# EAGLE design PIPCB (EAGLE 8.6.3)
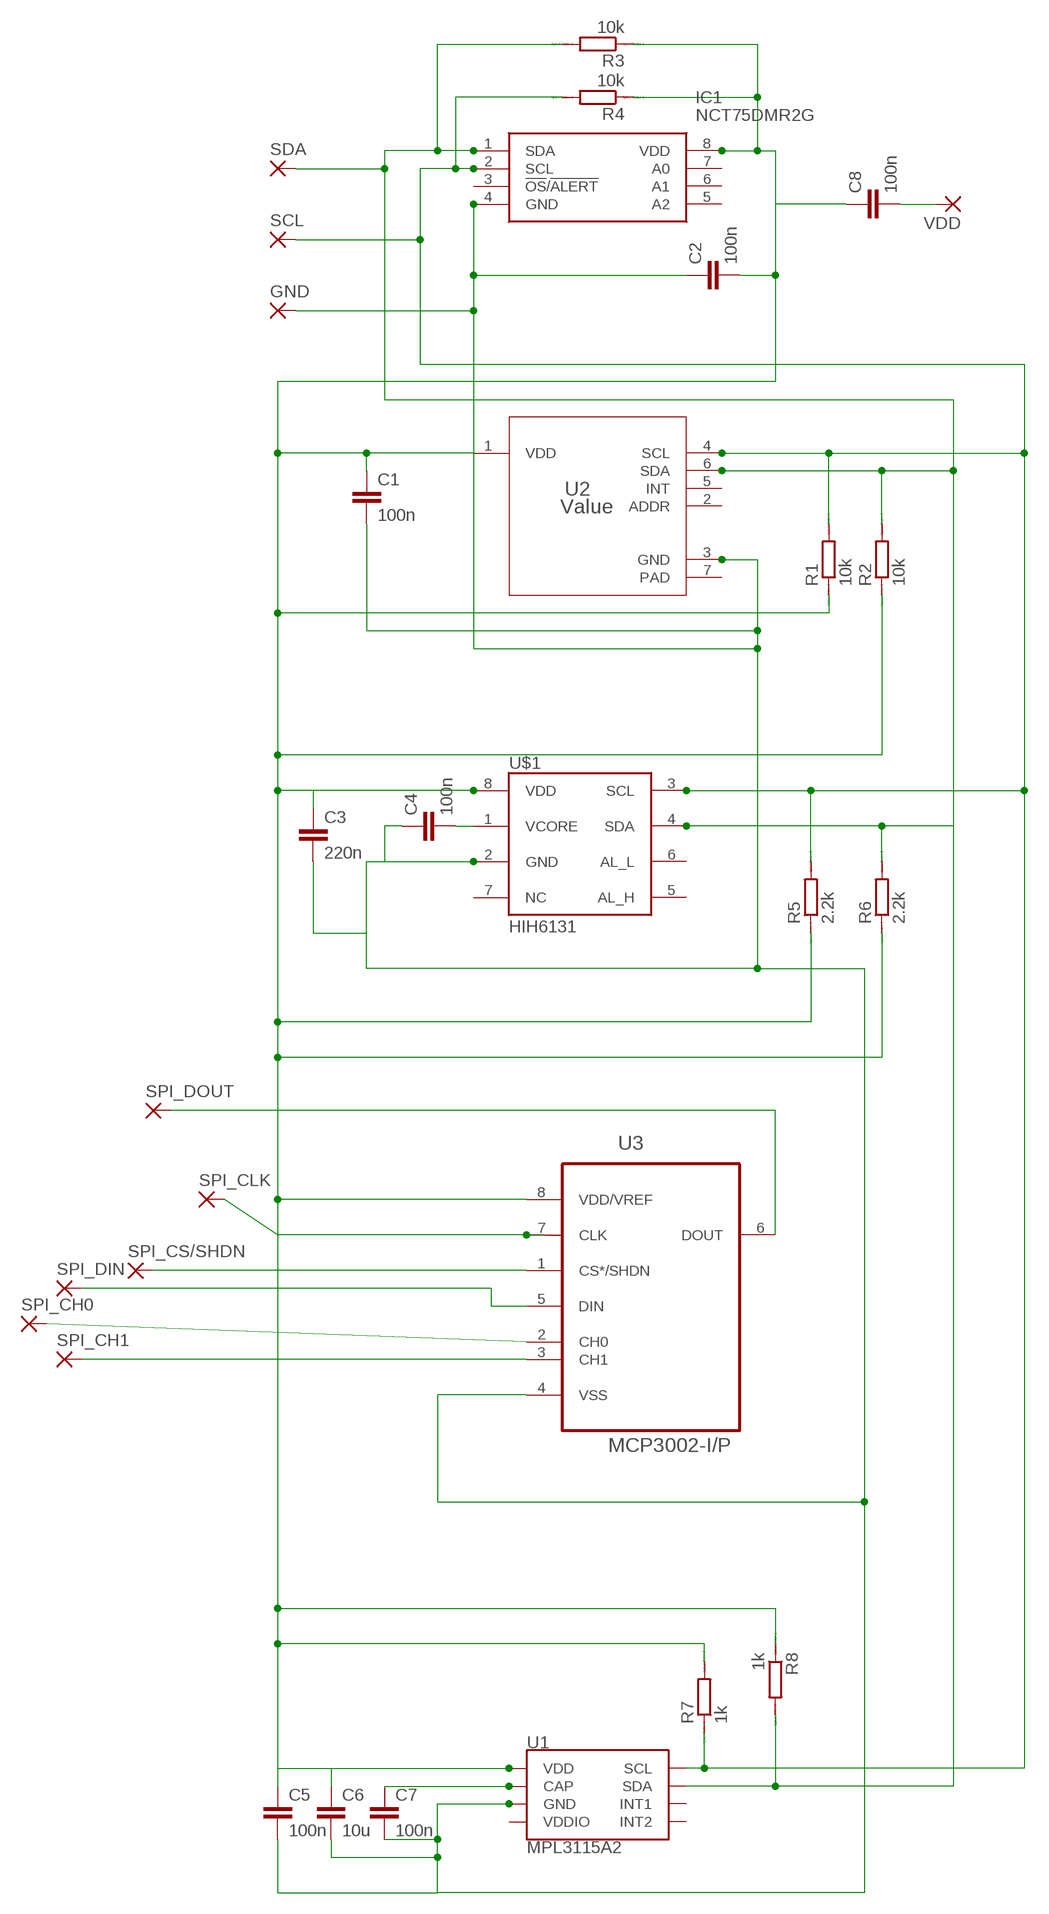
[diagram p0: schematic, sheet 1]

## Parts
C1  100n  C2,5-3  [C2.5-3]
C2  100n  C2,5-3  [C2.5-3]
C3  220n  C2,5-3  [C2.5-3]
C4  100n  C2,5-3  [C2.5-3]
C5  100n  C2,5-3  [C2.5-3]
C6  10u  C2,5-3  [C2.5-3]
C7  100n  C2,5-3  [C2.5-3]
C8  100n  C2,5-3  [C2.5-3]
GND  2,54/0,8  [2,54/0,8]
IC1  NCT75DMR2G  [SOP65P490X110-8N]
R1  10k  R0207/10  [0207/10]
R2  10k  R0207/10  [0207/10]
R3  10k  R0207/10  [0207/10]
R4  10k  R0207/10  [0207/10]
R5  2.2k  R0207/10  [0207/10]
R6  2.2k  R0207/10  [0207/10]
R7  1k  R0207/10  [0207/10]
R8  1k  R0207/10  [0207/10]
SCL  2,54/0,8  [2,54/0,8]
SDA  2,54/0,8  [2,54/0,8]
SPI_CH0  2,54/0,8  [2,54/0,8]
SPI_CH1  2,54/0,8  [2,54/0,8]
SPI_CLK  2,54/0,8  [2,54/0,8]
SPI_CS/SHDN  2,54/0,8  [2,54/0,8]
SPI_DIN  2,54/0,8  [2,54/0,8]
SPI_DOUT  2,54/0,8  [2,54/0,8]
U1  MPL3115A2  [LGA-8-5X3]
U2  Value  OPT3001DNPR  [DNP0006A]
U3  MCP3002-I/P  [DIP254P762X533-8]
U$1  HIH6131  [SOIC8]
VDD  2,54/0,8  [2,54/0,8]

## Nets
GND: C1.2 C2.1 C3.2 C4.1 C5.2 C6.2 C7.2 GND.1(P) IC1.4(GND) U1.3(GND) U2.3(GND) U3.4(VSS) U$1.2(GND)
N$1: C1.1 C2.2 C3.1 C5.1 C6.1 C8.1 IC1.8(VDD) R1.1 R2.1 R3.1 R4.1 R5.1 R6.1 R7.2 R8.1 U1.1(VDD) U2.1(VDD) U3.8(VDD/VREF) U$1.8(VDD)
N$2: C8.2 VDD.1(P)
N$3: IC1.2(SCL) R1.2 R4.2 R5.2 R7.1 SCL.1(P) U1.8(SCL) U2.4(SCL) U$1.3(SCL)
N$4: IC1.1(SDA) R2.2 R3.2 R6.2 R8.2 SDA.1(P) U1.7(SDA) U2.6(SDA) U$1.4(SDA)
N$6: C4.2 U$1.1(VCORE)
N$7: SPI_DOUT.1(P) U3.6(DOUT)
N$8: SPI_CLK.1(P) U3.7(CLK)
N$9: SPI_CS/SHDN.1(P) U3.1(CS*/SHDN)
N$10: C7.1 U1.2(CAP)
N$11: SPI_DIN.1(P) U3.5(DIN)
N$12: SPI_CH0.1(P) U3.2(CH0)
N$13: SPI_CH1.1(P) U3.3(CH1)
Unconnected: IC1.3(!OS!/!ALERT) IC1.5(A2) IC1.6(A1) IC1.7(A0) U1.5(INT2) U1.6(INT1) U2.2(ADDR) U2.5(INT) U2.7(PAD) U$1.5(AL_H) U$1.6(AL_L) U$1.7(NC)

## Power pins joined to a net without a drawn wire
VDDIO: U1.4(VDDIO)

## Library data of the parts
C1-C8 = capacitor-wima:C: CAPACITOR naming: grid - package width
GND SCL SDA SPI_CH0 SPI_CH1 SPI_CLK SPI_CS/SHDN SPI_DIN SPI_DOUT VDD = wirepad:2,54/0,8: THROUGH-HOLE PAD
IC1 = NCT75DMR2G:NCT75DMR2G: Source: Datasheet <http://www.onsemi.com/pub/Collateral/NCT75-D.PDF>; ALLIED_NUMBER: 70467170; ALLIED_PRICE/STOCK: http://www.alliedelec.com/on-semiconductor-nct75dmr2g/70467170/; HEIGHT: 1.1mm; MANUFACTURER_NAME: ON Semiconductor; MANUFACTURER_PART_NUMBER: NCT75DMR2G; RS_PART_NUMBER: 8064942; RS_PRICE/STOCK: http://uk.rs-online.com/web/p/products/8064942
R1-R8 = eagle-ltspice:R: RESISTOR, European symbol; SPICEMODEL: NONE; SPICEPREFIX: R
U1 = SparkFun-Sensors:MPL3115A2: NXP MPL3115A2 Digital Altimeter/Pressure Sensor The MPL3115A2 is a compact piezoresistive absolute pressure sensor with an I2C interface. MPL3115 has a wide operating range of 20kPa to 110 kPa, a range that covers all surface elevations on Earth. The fully internally compensated MEMS in conjunction with an embedded high resolution 24-bit equivalent ADC provide accurate pressure [Pascals] /altitude [meters] and temperature [degrees Celsius] data. Datasheet <http://cdn.sparkfun.com/datasheets/Sensors/Pressure/MPL3115A2.pdf> SparkFun Products SparkFun Altitude/Pressure Sensor Breakout - MPL3115A2 <https://www.sparkfun.com/products/11084> (SEN-11084) SparkFun Weather Shield <https://www.sparkfun.com/products/12081> (DEV-12081) SparkFun Photon Weather Shield <https://www.sparkfun.com/products/13630> (DEV-13630); PROD_ID: IC-10869
U2 = newlib:OPT3001DNPR; APPLICATION_BUILDNUMBER: *; COMPTYPE: IC; MANUFACTURER: Texas Instruments; MOUNTTYPE: SMT; PACKAGEREFERENCE: DNP0006A; PARTNUMBER: OPT3001DNP; PIN_COUNT: 7; REFDES: RefDes; ROHS: Y; TYPE: TYPE
U3 = newlib:MCP3002-I/P: IC, ADC, 10BIT, 200KSPS, DIP-8; MPN: MCP3002-I/P; OC_FARNELL: 1852015; OC_NEWARK: 61K2948; PACKAGE: DIP-8; SUPPLIER: Microchip
U$1 = SparkFun-Retired:HIH6131: Humidity sensor Not in catalog

## Board
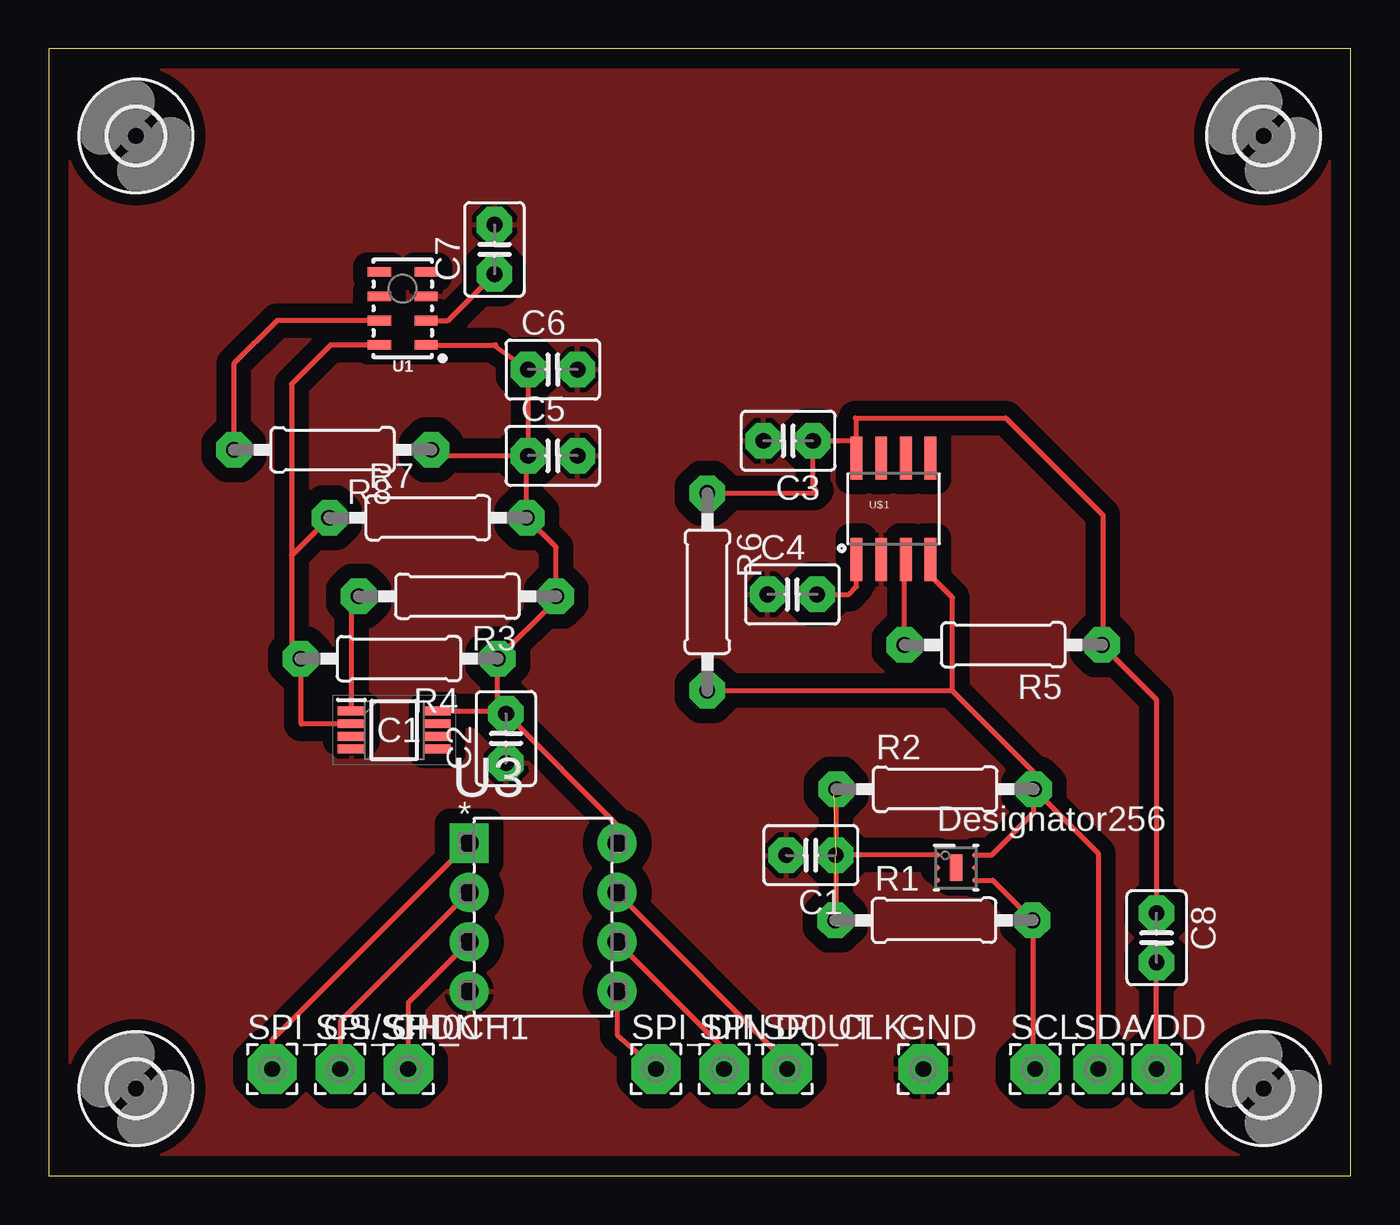
[diagram p1: board, top side]
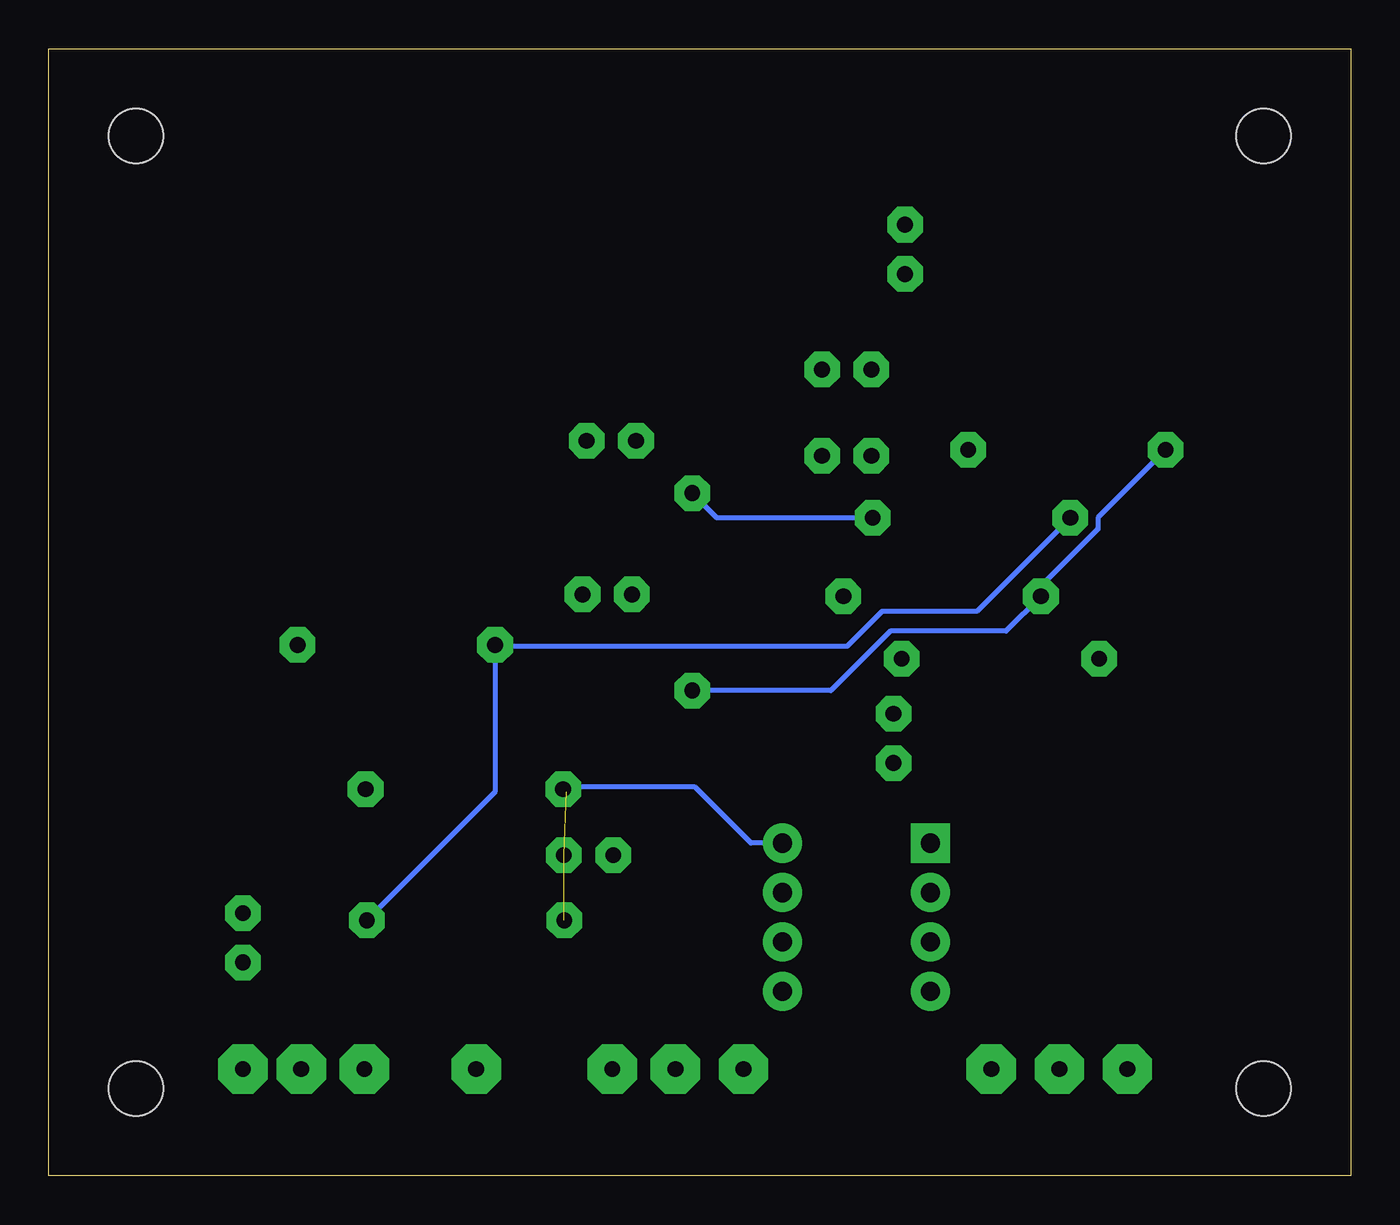
[diagram p2: board, bottom side, seen from below]

Size 67 x 58 mm. Coordinates in mm from the lower left corner, seen from the top.
Outline: 0,0 67,0 67,58 0,58 0,0
Copper layers (1*16): Top 0.035mm / dielectric 1.5mm / Bottom 0.035mm
Design rules "default *": minimum track width 15mil, minimum drill 0.8mm, track to track 30mil, track to pad 15mil, pad to pad 15mil, via to via 15mil, smd to smd 15mil, copper to edge 40mil, drill to drill 6mil, minimum pad ring 20mil, minimum via ring 20mil, stop-mask expansion 4mil, vias tented up to drill 0mil, thermal gap 10mil

### Footprints (pad centres in the part's own frame; a part is rotated, then mirrored left to right if it is on the bottom)
C2.5-3 = drill 0.813 pad 1.6 octagon: 1 -1.27,0; 2 1.27,0
2,54/0,8 = drill 0.813 pad 2.54 octagon: 1 0,0
SOP65P490X110-8N = smd 1.4 x 0.45: 1 -2.2,0.975; 2 -2.2,0.325; 3 -2.2,-0.325; 4 -2.2,-0.975; 5 2.2,-0.975; 6 2.2,-0.325; 7 2.2,0.325; 8 2.2,0.975
0207/10 = drill 0.813 octagon: 1 -5.08,0; 2 5.08,0
LGA-8-5X3 = smd 1.2 x 0.5: 1 -1.2,1.875; 2 -1.2,0.625; 3 -1.2,-0.625; 4 -1.2,-1.875; 5 1.2,-1.875; 6 1.2,-0.625; 7 1.2,0.625; 8 1.2,1.875
DNP0006A = smd 0.25 x 0.25: 1 -0.95,0.65; 2 -0.95,0; 3 -0.95,-0.655; 4 0.95,-0.65; 5 0.95,0; 6 0.95,0.65 | smd 0.65 x 1.35: 7 0,0
DIP254P762X533-8 = drill 0.991 square: 1 -7.62,7.62 | drill 0.991: 2 -7.62,5.08; 3 -7.62,2.54; 4 -7.62,0; 5 0,0; 6 0,2.54; 7 0,5.08; 8 0,7.62
SOIC8 = smd 0.61 x 2.21: 1 -1.905,-2.616; 2 -0.635,-2.616; 3 0.635,-2.616; 4 1.905,-2.616; 5 1.905,2.616; 6 0.635,2.616; 7 -0.635,2.616; 8 -1.905,2.616
2,8 = hole 2.8: 0,0

### Placement (x,y rotation side)
C1  39.22,16.5 180 top
C2  23.53,22.51 90 top
C3  38.05,37.82 180 top
C4  38.26,29.92 0 top
C5  25.94,37.05 0 top
C6  25.94,41.49 0 top
C7  22.94,47.67 90 top
C8  57,12.25 270 top
GND  45,5.5 0 top
IC1  17.78,22.94 0 top
R1  45.55,13.15 0 top
R2  45.61,19.9 0 top
R3  21.03,29.82 180 top
R4  18.03,26.61 180 top
R5  49.11,27.32 180 top
R6  33.89,30.05 270 top
R7  19.52,33.86 0 top
R8  14.61,37.36 180 top
SCL  50.75,5.5 0 top
SDA  54,5.5 0 top
SPI_CH0  15,5.5 0 top
SPI_CH1  18.5,5.5 0 top
SPI_CLK  38,5.5 0 top
SPI_CS/SHDN  11.5,5.5 0 top
SPI_DIN  31.25,5.5 0 top
SPI_DOUT  34.75,5.5 0 top
U1  18.22,44.63 180 top
U2  46.69,15.86 0 top
U3  29.25,9.5 0 top
U$1  43.47,34.32 0 top
U$4  [2,8]  4.5,4.5 270 top
U$5  [2,8]  4.5,53.5 270 top
U$6  [2,8]  62.5,4.5 270 top
U$7  [2,8]  62.5,53.5 270 top
VDD  57,5.5 0 top

### Tracks (layer width: path | path; a pad name or v marks a point on that pad's centre or on a via)
GND
  pour Top: 0,58 0,0 67,0 67,58
N$1  (2 unrouted)
  Top 0.254: IC1.8 23.39,23.91 C2.2 | C2.2 23.11,24.2 R4.1 26.11,29.61 R3.1 26.11,32.35 R7.2 | R6.1 39.38,35.13 39.5,35.25 39.32,35.43 C3.1 41.43,37.82 41.56,37.69 U$1.8 41.56,38.94 41.5,39 49.25,39 54.25,34 54.25,27.38 R5.1 57,24.51 C8.1 | U1.1 22.91,42.76 | 22.91,42.76 C6.1 C5.1 | R7.2 24.67,33.93 | 40.49,13.17 R1.1 | 22.91,42.76 23,42.76 | R7.2 24.6,36.98 C5.1 | R8.1 20,37.05 C5.1 | R2.1 40.38,19.75 | 29.25,18 U3.8 29.25,18.06 C2.2 | U2.1 C1.1
  Bottom 0.254: R7.2 32.62,33.86 R6.1 | U3.8 30.87,17.12 33.75,20 40.43,20 R2.1
N$2
  Top 0.254: VDD.1 C8.2
N$3
  Top 0.254: IC1.2 13.02,23.27 13,23.25 13,26.56 R4.2 12.5,27.06 12.5,31.92 | R5.2 44.03,31.63 U$1.3 | R7.1 12.5,31.92 | U2.4 48.57,15.21 R1.2 50.63,5.62 SCL.1 | U1.8 14.51,42.76 12.5,40.75 12.5,31.92
  Bottom 0.254: R5.2 44.03,27.25 | 44.03,27.25 44.03,19.75 R1.2 | R7.1 19.25,29.05 24.12,29.05 25.92,27.25 44.03,27.25
N$4
  Top 0.254: IC1.1 15.58,29.45 R3.2 | 45.47,31.61 45.41,31.66 | 45.41,31.66 U$1.4 | R6.2 46.47,24.97 | 46.47,24.97 46.5,25 46.5,29.75 45.41,30.84 45.41,31.66 | U1.7 11.76,44.01 9.53,41.78 R8.2 | 46.47,24.97 50.69,20.75 R2.2 | R2.2 54,16.59 SDA.1 | U2.6 48.49,16.51 48.5,16.5 50.69,18.69 R2.2
  Bottom 0.254: R8.2 13.02,33.87 13.02,33.27 15.95,30.34 R3.2 17.74,28.03 23.7,28.03 26.76,24.97 R6.2
N$6
  Top 0.254: U$1.1 41.56,31.18 | 41.56,31.18 41.75,31 | C4.2 41.17,29.92 41.56,30.32 41.56,31.18
N$7
  Top 0.254: U3.6 34.75,6.54 SPI_DOUT.1
N$8
  Top 0.254: U3.7 38,5.83 SPI_CLK.1
N$9
  Top 0.254: U3.1 11.5,6.99 SPI_CS/SHDN.1
N$10
  Top 0.254: U1.2 20.55,44.01 C7.1
N$11
  Top 0.254: U3.5 29.25,7.25 SPI_DIN.1
N$12
  Top 0.254: U3.2 15,7.95 SPI_CH0.1
N$13
  Top 0.254: U3.3 18.5,8.91 SPI_CH1.1
N$14
  Top 0.254: 40.5,19.75 40.5,13.25